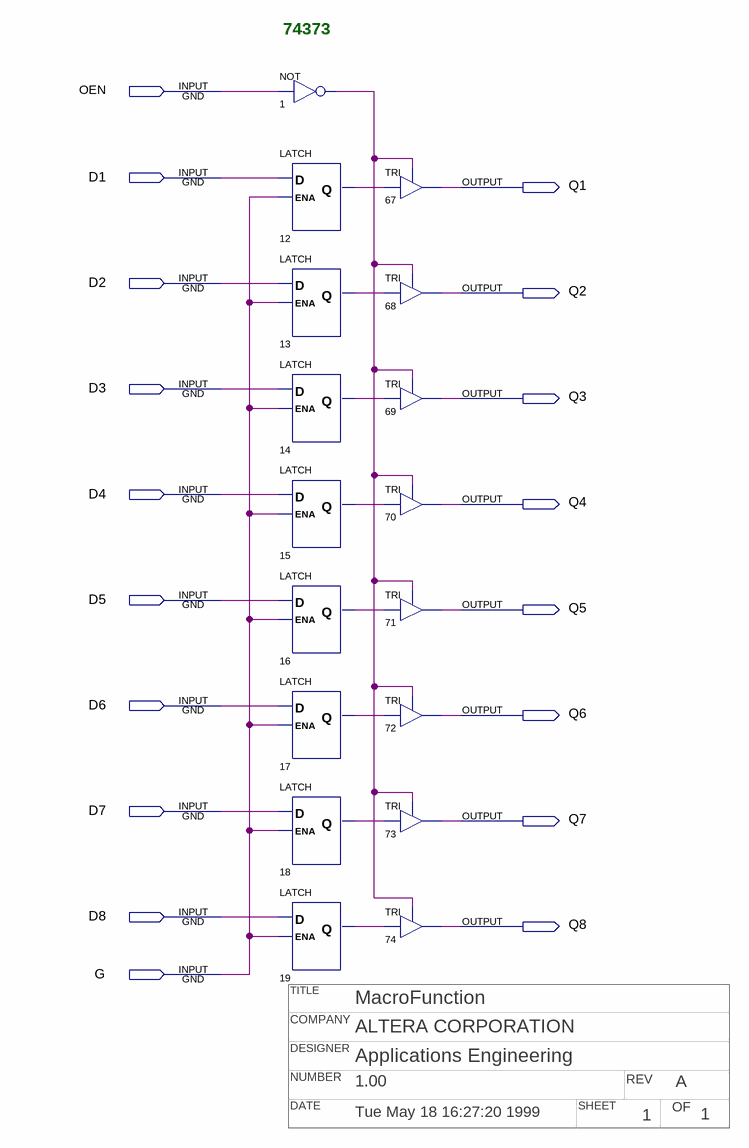
[diagram p0: schematic sheet]
// Quartus schematic 74373.bdf as structural Verilog: 17 symbols, 18 pins
// Title block: TITLE: MacroFunction; COMPANY: ALTERA CORPORATION; DESIGNER: Applications Engineering; NUMBER: 1.00; REV: A; DATE: Tue May 18 16:27:20 1999; SHEET: 1; OF: 1
module \74373  (
  input  OEN,
  input  D1,
  input  D2,
  input  D3,
  input  D4,
  input  D5,
  input  D6,
  input  D7,
  input  D8,
  input  G,
  output Q1,
  output Q2,
  output Q3,
  output Q4,
  output Q5,
  output Q6,
  output Q7,
  output Q8
);

  wire n1_out, n12_q, n13_q, n14_q, n15_q, n16_q, n17_q, n18_q, n19_q;

  not u_1 (n1_out, OEN);
  LATCH u_12 (.D(D1), .ENA(G), .Q(n12_q));
  LATCH u_13 (.D(D2), .ENA(G), .Q(n13_q));
  LATCH u_14 (.D(D3), .ENA(G), .Q(n14_q));
  LATCH u_15 (.D(D4), .ENA(G), .Q(n15_q));
  LATCH u_16 (.D(D5), .ENA(G), .Q(n16_q));
  LATCH u_17 (.D(D6), .ENA(G), .Q(n17_q));
  LATCH u_18 (.D(D7), .ENA(G), .Q(n18_q));
  LATCH u_19 (.D(D8), .ENA(G), .Q(n19_q));
  TRI u_67 (.IN(n12_q), .OE(n1_out), .OUT(Q1));
  TRI u_68 (.IN(n13_q), .OE(n1_out), .OUT(Q2));
  TRI u_69 (.IN(n14_q), .OE(n1_out), .OUT(Q3));
  TRI u_70 (.IN(n15_q), .OE(n1_out), .OUT(Q4));
  TRI u_71 (.IN(n16_q), .OE(n1_out), .OUT(Q5));
  TRI u_72 (.IN(n17_q), .OE(n1_out), .OUT(Q6));
  TRI u_73 (.IN(n18_q), .OE(n1_out), .OUT(Q7));
  TRI u_74 (.IN(n19_q), .OE(n1_out), .OUT(Q8));

  // Notes on the sheet:
  //   74373
endmodule
